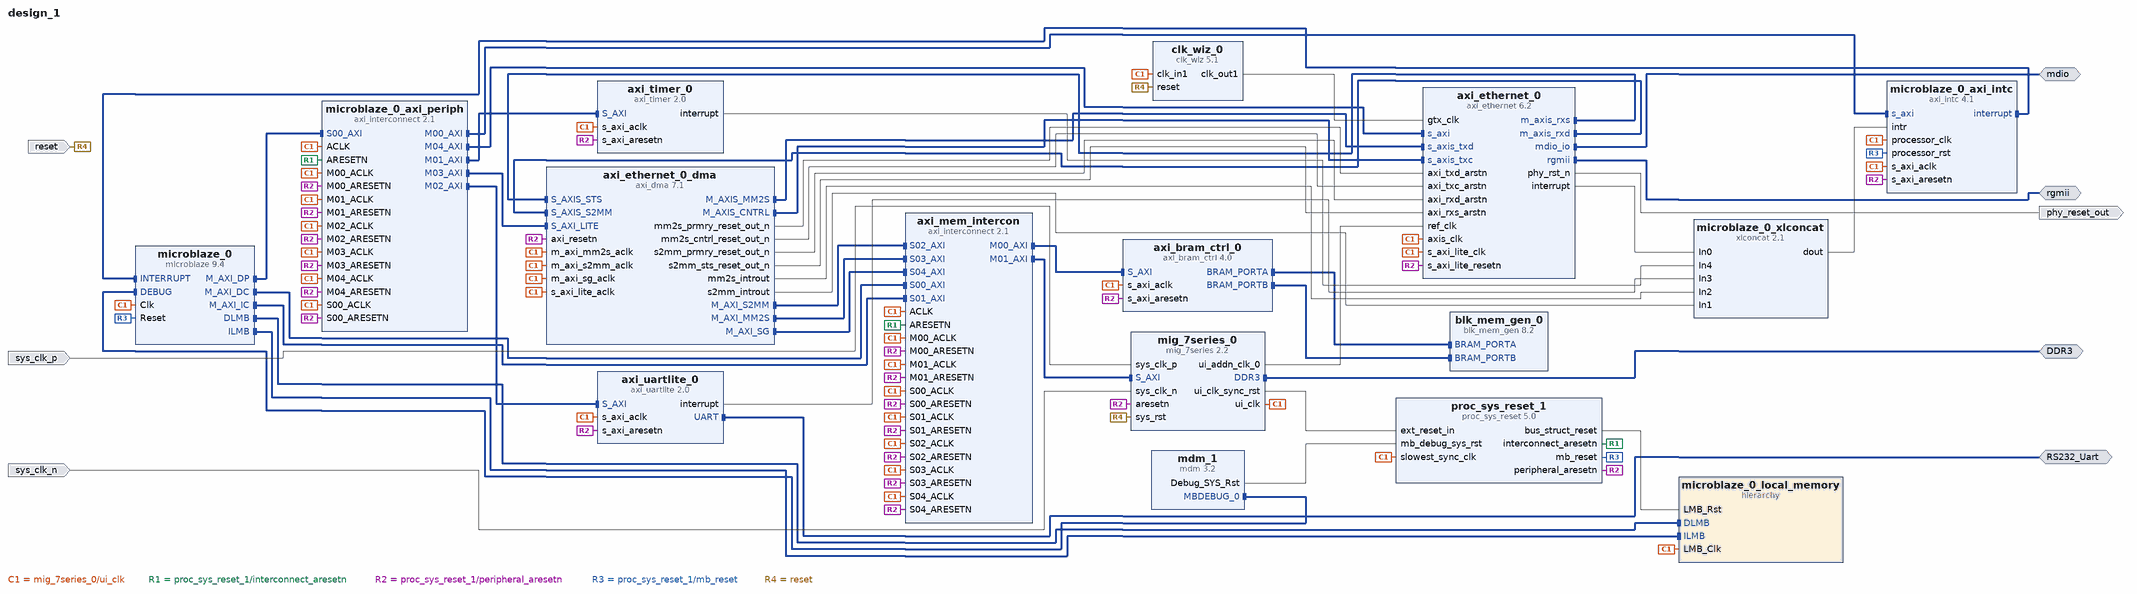
[diagram p0: block diagram of the top level]
# Vivado block design design_1, Vivado 2014.3
create_bd_design design_1

create_bd_intf_port -mode Master -vlnv xilinx.com:interface:uart_rtl:1.0 RS232_Uart
create_bd_intf_port -mode Master -vlnv xilinx.com:interface:ddrx_rtl:1.0 DDR3
create_bd_intf_port -mode Master -vlnv xilinx.com:interface:mdio_io:1.0 mdio
create_bd_intf_port -mode Master -vlnv xilinx.com:interface:rgmii_rtl:1.0 rgmii
create_bd_port -dir I -type rst reset
set_property -dict {CONFIG.POLARITY ACTIVE_HIGH} [get_bd_ports reset]
create_bd_port -dir I sys_clk_p
create_bd_port -dir I sys_clk_n
create_bd_port -dir O -type rst phy_reset_out

create_bd_cell -type hier microblaze_0_local_memory
create_bd_cell -type ip -vlnv xilinx.com:ip:xlconcat:2.1 microblaze_0_xlconcat
set_property -dict {CONFIG.NUM_PORTS 5} [get_bd_cells microblaze_0_xlconcat]
create_bd_cell -type ip -vlnv xilinx.com:ip:axi_bram_ctrl:4.0 axi_bram_ctrl_0
set_property -dict {CONFIG.SUPPORTS_NARROW_BURST 0} [get_bd_cells axi_bram_ctrl_0]
create_bd_cell -type ip -vlnv xilinx.com:ip:axi_ethernet:6.2 axi_ethernet_0
set_property -dict [list \
  CONFIG.USE_BOARD_FLOW true \
  CONFIG.ETHERNET_BOARD_INTERFACE rgmii \
  CONFIG.MDIO_BOARD_INTERFACE mdio_io \
  CONFIG.PHYRST_BOARD_INTERFACE phy_reset_out \
  CONFIG.RXMEM 32k \
  CONFIG.TXMEM 32k \
  CONFIG.TXCSUM Full \
  CONFIG.RXCSUM Full \
] [get_bd_cells axi_ethernet_0]
create_bd_cell -type ip -vlnv xilinx.com:ip:axi_dma:7.1 axi_ethernet_0_dma
set_property -dict [list \
  CONFIG.c_include_mm2s_dre 1 \
  CONFIG.c_mm2s_burst_size 32 \
  CONFIG.c_sg_use_stsapp_length 1 \
  CONFIG.c_include_s2mm_dre 1 \
  CONFIG.c_s2mm_burst_size 32 \
] [get_bd_cells axi_ethernet_0_dma]
create_bd_cell -type ip -vlnv xilinx.com:ip:axi_interconnect:2.1 axi_mem_intercon
set_property -dict {CONFIG.NUM_SI 5 CONFIG.NUM_MI 2 CONFIG.STRATEGY 2} [get_bd_cells axi_mem_intercon]
create_bd_cell -type ip -vlnv xilinx.com:ip:axi_timer:2.0 axi_timer_0
create_bd_cell -type ip -vlnv xilinx.com:ip:axi_uartlite:2.0 axi_uartlite_0
set_property -dict {CONFIG.USE_BOARD_FLOW true CONFIG.UARTLITE_BOARD_INTERFACE RS232_Uart} [get_bd_cells axi_uartlite_0]
create_bd_cell -type ip -vlnv xilinx.com:ip:blk_mem_gen:8.2 blk_mem_gen_0
set_property -dict [list \
  CONFIG.Memory_Type True_Dual_Port_RAM \
  CONFIG.Enable_B Use_ENB_Pin \
  CONFIG.Use_RSTB_Pin true \
  CONFIG.Port_B_Clock 100 \
  CONFIG.Port_B_Write_Rate 50 \
  CONFIG.Port_B_Enable_Rate 100 \
] [get_bd_cells blk_mem_gen_0]
create_bd_cell -type ip -vlnv xilinx.com:ip:clk_wiz:5.1 clk_wiz_0
set_property -dict {CONFIG.CLKOUT1_REQUESTED_OUT_FREQ 125.000 CONFIG.CLKOUT1_JITTER 125.247} [get_bd_cells clk_wiz_0]
create_bd_cell -type ip -vlnv xilinx.com:ip:mdm:3.2 mdm_1
create_bd_cell -type ip -vlnv xilinx.com:ip:microblaze:9.4 microblaze_0
set_property -dict [list \
  CONFIG.C_FREQ 100000000 \
  CONFIG.C_D_AXI 1 \
  CONFIG.C_D_LMB 1 \
  CONFIG.C_I_LMB 1 \
  CONFIG.C_M_AXI_DC_USER_SIGNALS 0 \
  CONFIG.C_M_AXI_IC_USER_SIGNALS 0 \
  CONFIG.G_TEMPLATE_LIST 2 \
  CONFIG.C_USE_MSR_INSTR 1 \
  CONFIG.C_USE_PCMP_INSTR 1 \
  CONFIG.C_USE_BARREL 1 \
  CONFIG.C_USE_DIV 1 \
  CONFIG.C_USE_HW_MUL 2 \
  CONFIG.C_USE_FPU 2 \
  CONFIG.C_DEBUG_ENABLED 1 \
  CONFIG.C_ICACHE_BASEADDR 0x80000000 \
  CONFIG.C_ICACHE_HIGHADDR 0xBFFFFFFF \
  CONFIG.C_USE_ICACHE 1 \
  CONFIG.C_CACHE_BYTE_SIZE 65536 \
  CONFIG.C_ICACHE_LINE_LEN 8 \
  CONFIG.C_ICACHE_ALWAYS_USED 1 \
  CONFIG.C_ICACHE_VICTIMS 0 \
  CONFIG.C_ICACHE_STREAMS 0 \
  CONFIG.C_DCACHE_BASEADDR 0x80000000 \
  CONFIG.C_DCACHE_HIGHADDR 0xBFFFFFFF \
  CONFIG.C_USE_DCACHE 1 \
  CONFIG.C_DCACHE_BYTE_SIZE 65536 \
  CONFIG.C_DCACHE_LINE_LEN 8 \
  CONFIG.C_DCACHE_ALWAYS_USED 1 \
  CONFIG.C_DCACHE_USE_WRITEBACK 1 \
  CONFIG.C_DCACHE_VICTIMS 0 \
  CONFIG.C_USE_INTERRUPT 2 \
  CONFIG.C_USE_EXT_BRK 0 \
  CONFIG.C_USE_EXT_NM_BRK 0 \
  CONFIG.C_USE_BRANCH_TARGET_CACHE 1 \
] [get_bd_cells microblaze_0]
create_bd_cell -type ip -vlnv xilinx.com:ip:axi_intc:4.1 microblaze_0_axi_intc
set_property -dict [list \
  CONFIG.C_KIND_OF_INTR 0xFFFFFFE8 \
  CONFIG.C_ASYNC_INTR 0xFFFFFFE1 \
  CONFIG.C_HAS_FAST 1 \
  CONFIG.C_DISABLE_SYNCHRONIZERS 1 \
] [get_bd_cells microblaze_0_axi_intc]
create_bd_cell -type ip -vlnv xilinx.com:ip:axi_interconnect:2.1 microblaze_0_axi_periph
set_property -dict {CONFIG.NUM_MI 5} [get_bd_cells microblaze_0_axi_periph]
create_bd_cell -type ip -vlnv xilinx.com:ip:mig_7series:2.2 mig_7series_0
set_property -dict {CONFIG.XML_INPUT_FILE mig_a.prj CONFIG.RESET_BOARD_INTERFACE reset} [get_bd_cells mig_7series_0]
create_bd_cell -type ip -vlnv xilinx.com:ip:proc_sys_reset:5.0 proc_sys_reset_1
set_property -dict {CONFIG.C_AUX_RESET_HIGH 0} [get_bd_cells proc_sys_reset_1]

# ---- hierarchy /microblaze_0_local_memory ----
current_bd_instance /microblaze_0_local_memory
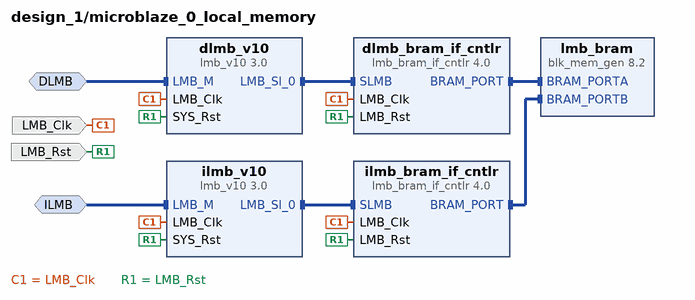
[diagram p1: block diagram inside /microblaze_0_local_memory]
create_bd_intf_pin -mode MirroredMaster -vlnv xilinx.com:interface:lmb_rtl:1.0 DLMB
create_bd_intf_pin -mode MirroredMaster -vlnv xilinx.com:interface:lmb_rtl:1.0 ILMB
create_bd_pin -dir I LMB_Clk
create_bd_pin -dir I LMB_Rst

create_bd_cell -type ip -vlnv xilinx.com:ip:lmb_v10:3.0 ilmb_v10
create_bd_cell -type ip -vlnv xilinx.com:ip:lmb_v10:3.0 dlmb_v10
create_bd_cell -type ip -vlnv xilinx.com:ip:lmb_bram_if_cntlr:4.0 dlmb_bram_if_cntlr
set_property -dict {CONFIG.C_MASK 0xc0000000 CONFIG.C_ECC 0} [get_bd_cells dlmb_bram_if_cntlr]
create_bd_cell -type ip -vlnv xilinx.com:ip:lmb_bram_if_cntlr:4.0 ilmb_bram_if_cntlr
set_property -dict {CONFIG.C_MASK 0x80000000 CONFIG.C_ECC 0} [get_bd_cells ilmb_bram_if_cntlr]
create_bd_cell -type ip -vlnv xilinx.com:ip:blk_mem_gen:8.2 lmb_bram
set_property -dict [list \
  CONFIG.Memory_Type True_Dual_Port_RAM \
  CONFIG.Enable_B Use_ENB_Pin \
  CONFIG.Use_RSTB_Pin true \
  CONFIG.Port_B_Clock 100 \
  CONFIG.Port_B_Write_Rate 50 \
  CONFIG.Port_B_Enable_Rate 100 \
  CONFIG.use_bram_block BRAM_Controller \
] [get_bd_cells lmb_bram]

# ---- connections ----

current_bd_instance /microblaze_0_local_memory
connect_bd_intf_net -intf_net microblaze_0_dlmb_bus [get_bd_intf_pins dlmb_v10/LMB_Sl_0] [get_bd_intf_pins dlmb_bram_if_cntlr/SLMB]
connect_bd_intf_net -intf_net microblaze_0_ilmb_bus [get_bd_intf_pins ilmb_v10/LMB_Sl_0] [get_bd_intf_pins ilmb_bram_if_cntlr/SLMB]
connect_bd_intf_net -intf_net microblaze_0_dlmb_cntlr [get_bd_intf_pins dlmb_bram_if_cntlr/BRAM_PORT] [get_bd_intf_pins lmb_bram/BRAM_PORTA]
connect_bd_intf_net -intf_net microblaze_0_ilmb_cntlr [get_bd_intf_pins ilmb_bram_if_cntlr/BRAM_PORT] [get_bd_intf_pins lmb_bram/BRAM_PORTB]
connect_bd_intf_net -intf_net microblaze_0_dlmb [get_bd_intf_pins DLMB] [get_bd_intf_pins dlmb_v10/LMB_M]
connect_bd_intf_net -intf_net microblaze_0_ilmb [get_bd_intf_pins ILMB] [get_bd_intf_pins ilmb_v10/LMB_M]
connect_bd_net -net microblaze_0_Clk [get_bd_pins LMB_Clk] \
  [get_bd_pins ilmb_v10/LMB_Clk] [get_bd_pins dlmb_v10/LMB_Clk] [get_bd_pins dlmb_bram_if_cntlr/LMB_Clk] \
  [get_bd_pins ilmb_bram_if_cntlr/LMB_Clk]
connect_bd_net -net proc_sys_reset_1_bus_struct_reset [get_bd_pins LMB_Rst] \
  [get_bd_pins ilmb_v10/SYS_Rst] [get_bd_pins dlmb_v10/SYS_Rst] [get_bd_pins dlmb_bram_if_cntlr/LMB_Rst] \
  [get_bd_pins ilmb_bram_if_cntlr/LMB_Rst]

current_bd_instance /
connect_bd_intf_net [get_bd_intf_pins microblaze_0/DLMB] [get_bd_intf_pins microblaze_0_local_memory/DLMB]
connect_bd_intf_net [get_bd_intf_pins microblaze_0/ILMB] [get_bd_intf_pins microblaze_0_local_memory/ILMB]
connect_bd_intf_net -intf_net microblaze_0_axi_dp [get_bd_intf_pins microblaze_0_axi_periph/S00_AXI] [get_bd_intf_pins microblaze_0/M_AXI_DP]
connect_bd_intf_net [get_bd_intf_pins microblaze_0_axi_intc/interrupt] [get_bd_intf_pins microblaze_0/INTERRUPT]
connect_bd_intf_net -intf_net microblaze_0_intc_axi [get_bd_intf_pins microblaze_0_axi_periph/M00_AXI] [get_bd_intf_pins microblaze_0_axi_intc/s_axi]
connect_bd_intf_net [get_bd_intf_pins mdm_1/MBDEBUG_0] [get_bd_intf_pins microblaze_0/DEBUG]
connect_bd_intf_net [get_bd_intf_pins microblaze_0_axi_periph/M01_AXI] [get_bd_intf_pins axi_timer_0/S_AXI]
connect_bd_intf_net [get_bd_intf_pins microblaze_0_axi_periph/M02_AXI] [get_bd_intf_pins axi_uartlite_0/S_AXI]
connect_bd_intf_net [get_bd_intf_pins axi_bram_ctrl_0/BRAM_PORTA] [get_bd_intf_pins blk_mem_gen_0/BRAM_PORTA]
connect_bd_intf_net [get_bd_intf_pins axi_bram_ctrl_0/BRAM_PORTB] [get_bd_intf_pins blk_mem_gen_0/BRAM_PORTB]
connect_bd_intf_net [get_bd_intf_pins microblaze_0/M_AXI_DC] [get_bd_intf_pins axi_mem_intercon/S00_AXI]
connect_bd_intf_net [get_bd_intf_pins axi_mem_intercon/M00_AXI] [get_bd_intf_pins axi_bram_ctrl_0/S_AXI]
connect_bd_intf_net [get_bd_intf_pins microblaze_0/M_AXI_IC] [get_bd_intf_pins axi_mem_intercon/S01_AXI]
connect_bd_intf_net [get_bd_intf_pins axi_mem_intercon/M01_AXI] [get_bd_intf_pins mig_7series_0/S_AXI]
connect_bd_intf_net [get_bd_intf_pins axi_ethernet_0_dma/M_AXIS_MM2S] [get_bd_intf_pins axi_ethernet_0/s_axis_txd]
connect_bd_intf_net [get_bd_intf_pins axi_ethernet_0_dma/M_AXIS_CNTRL] [get_bd_intf_pins axi_ethernet_0/s_axis_txc]
connect_bd_intf_net [get_bd_intf_pins axi_ethernet_0_dma/S_AXIS_STS] [get_bd_intf_pins axi_ethernet_0/m_axis_rxs]
connect_bd_intf_net [get_bd_intf_pins axi_ethernet_0_dma/S_AXIS_S2MM] [get_bd_intf_pins axi_ethernet_0/m_axis_rxd]
connect_bd_intf_net [get_bd_intf_pins axi_ethernet_0_dma/M_AXI_S2MM] [get_bd_intf_pins axi_mem_intercon/S02_AXI]
connect_bd_intf_net [get_bd_intf_pins axi_ethernet_0_dma/M_AXI_MM2S] [get_bd_intf_pins axi_mem_intercon/S03_AXI]
connect_bd_intf_net [get_bd_intf_pins axi_ethernet_0_dma/M_AXI_SG] [get_bd_intf_pins axi_mem_intercon/S04_AXI]
connect_bd_intf_net [get_bd_intf_pins microblaze_0_axi_periph/M03_AXI] [get_bd_intf_pins axi_ethernet_0_dma/S_AXI_LITE]
connect_bd_intf_net [get_bd_intf_pins microblaze_0_axi_periph/M04_AXI] [get_bd_intf_pins axi_ethernet_0/s_axi]
connect_bd_intf_net [get_bd_intf_ports RS232_Uart] [get_bd_intf_pins axi_uartlite_0/UART]
connect_bd_intf_net [get_bd_intf_ports DDR3] [get_bd_intf_pins mig_7series_0/DDR3]
connect_bd_intf_net -intf_net axi_ethernet_0_mdio [get_bd_intf_ports mdio] [get_bd_intf_pins axi_ethernet_0/mdio_io]
connect_bd_intf_net [get_bd_intf_ports rgmii] [get_bd_intf_pins axi_ethernet_0/rgmii]
connect_bd_net -net microblaze_0_intr [get_bd_pins microblaze_0_xlconcat/dout] [get_bd_pins microblaze_0_axi_intc/intr]
connect_bd_net -net microblaze_0_Clk [get_bd_pins mig_7series_0/ui_clk] \
  [get_bd_pins microblaze_0_local_memory/LMB_Clk] [get_bd_pins axi_bram_ctrl_0/s_axi_aclk] \
  [get_bd_pins axi_ethernet_0/s_axi_lite_clk] [get_bd_pins axi_ethernet_0/axis_clk] \
  [get_bd_pins axi_ethernet_0_dma/s_axi_lite_aclk] [get_bd_pins axi_ethernet_0_dma/m_axi_sg_aclk] \
  [get_bd_pins axi_ethernet_0_dma/m_axi_mm2s_aclk] [get_bd_pins axi_ethernet_0_dma/m_axi_s2mm_aclk] \
  [get_bd_pins axi_mem_intercon/ACLK] [get_bd_pins axi_mem_intercon/S00_ACLK] [get_bd_pins axi_mem_intercon/S01_ACLK] \
  [get_bd_pins axi_mem_intercon/S02_ACLK] [get_bd_pins axi_mem_intercon/S03_ACLK] [get_bd_pins axi_mem_intercon/S04_ACLK] \
  [get_bd_pins axi_mem_intercon/M00_ACLK] [get_bd_pins axi_mem_intercon/M01_ACLK] [get_bd_pins axi_timer_0/s_axi_aclk] \
  [get_bd_pins axi_uartlite_0/s_axi_aclk] [get_bd_pins clk_wiz_0/clk_in1] [get_bd_pins microblaze_0/Clk] \
  [get_bd_pins microblaze_0_axi_intc/s_axi_aclk] [get_bd_pins microblaze_0_axi_intc/processor_clk] \
  [get_bd_pins microblaze_0_axi_periph/ACLK] [get_bd_pins microblaze_0_axi_periph/S00_ACLK] \
  [get_bd_pins microblaze_0_axi_periph/M00_ACLK] [get_bd_pins microblaze_0_axi_periph/M01_ACLK] \
  [get_bd_pins microblaze_0_axi_periph/M02_ACLK] [get_bd_pins microblaze_0_axi_periph/M03_ACLK] \
  [get_bd_pins microblaze_0_axi_periph/M04_ACLK] [get_bd_pins proc_sys_reset_1/slowest_sync_clk]
connect_bd_net [get_bd_pins proc_sys_reset_1/bus_struct_reset] [get_bd_pins microblaze_0_local_memory/LMB_Rst]
connect_bd_net [get_bd_pins proc_sys_reset_1/interconnect_aresetn] \
  [get_bd_pins axi_mem_intercon/ARESETN] [get_bd_pins microblaze_0_axi_periph/ARESETN]
connect_bd_net [get_bd_pins mdm_1/Debug_SYS_Rst] [get_bd_pins proc_sys_reset_1/mb_debug_sys_rst]
connect_bd_net [get_bd_pins proc_sys_reset_1/peripheral_aresetn] \
  [get_bd_pins axi_bram_ctrl_0/s_axi_aresetn] [get_bd_pins axi_ethernet_0/s_axi_lite_resetn] \
  [get_bd_pins axi_ethernet_0_dma/axi_resetn] [get_bd_pins axi_mem_intercon/S00_ARESETN] \
  [get_bd_pins axi_mem_intercon/S01_ARESETN] [get_bd_pins axi_mem_intercon/S02_ARESETN] \
  [get_bd_pins axi_mem_intercon/S03_ARESETN] [get_bd_pins axi_mem_intercon/S04_ARESETN] \
  [get_bd_pins axi_mem_intercon/M00_ARESETN] [get_bd_pins axi_mem_intercon/M01_ARESETN] \
  [get_bd_pins axi_timer_0/s_axi_aresetn] [get_bd_pins axi_uartlite_0/s_axi_aresetn] \
  [get_bd_pins microblaze_0_axi_intc/s_axi_aresetn] [get_bd_pins microblaze_0_axi_periph/S00_ARESETN] \
  [get_bd_pins microblaze_0_axi_periph/M00_ARESETN] [get_bd_pins microblaze_0_axi_periph/M01_ARESETN] \
  [get_bd_pins microblaze_0_axi_periph/M02_ARESETN] [get_bd_pins microblaze_0_axi_periph/M03_ARESETN] \
  [get_bd_pins microblaze_0_axi_periph/M04_ARESETN] [get_bd_pins mig_7series_0/aresetn]
connect_bd_net [get_bd_pins proc_sys_reset_1/mb_reset] [get_bd_pins microblaze_0/Reset] [get_bd_pins microblaze_0_axi_intc/processor_rst]
connect_bd_net [get_bd_pins mig_7series_0/ui_clk_sync_rst] [get_bd_pins proc_sys_reset_1/ext_reset_in]
connect_bd_net [get_bd_pins axi_timer_0/interrupt] [get_bd_pins microblaze_0_xlconcat/In4]
connect_bd_net [get_bd_pins axi_uartlite_0/interrupt] [get_bd_pins microblaze_0_xlconcat/In3]
connect_bd_net [get_bd_ports reset] [get_bd_pins clk_wiz_0/reset] [get_bd_pins mig_7series_0/sys_rst]
connect_bd_net [get_bd_ports sys_clk_p] [get_bd_pins mig_7series_0/sys_clk_p]
connect_bd_net [get_bd_ports sys_clk_n] [get_bd_pins mig_7series_0/sys_clk_n]
connect_bd_net [get_bd_pins axi_ethernet_0_dma/mm2s_prmry_reset_out_n] [get_bd_pins axi_ethernet_0/axi_txd_arstn]
connect_bd_net [get_bd_pins axi_ethernet_0_dma/mm2s_cntrl_reset_out_n] [get_bd_pins axi_ethernet_0/axi_txc_arstn]
connect_bd_net [get_bd_pins axi_ethernet_0_dma/s2mm_prmry_reset_out_n] [get_bd_pins axi_ethernet_0/axi_rxd_arstn]
connect_bd_net [get_bd_pins axi_ethernet_0_dma/s2mm_sts_reset_out_n] [get_bd_pins axi_ethernet_0/axi_rxs_arstn]
connect_bd_net [get_bd_pins mig_7series_0/ui_addn_clk_0] [get_bd_pins axi_ethernet_0/ref_clk]
connect_bd_net [get_bd_pins axi_ethernet_0_dma/mm2s_introut] [get_bd_pins microblaze_0_xlconcat/In2]
connect_bd_net [get_bd_pins axi_ethernet_0_dma/s2mm_introut] [get_bd_pins microblaze_0_xlconcat/In1]
connect_bd_net [get_bd_pins axi_ethernet_0/interrupt] [get_bd_pins microblaze_0_xlconcat/In0]
connect_bd_net [get_bd_pins axi_ethernet_0/phy_rst_n] [get_bd_ports phy_reset_out]
connect_bd_net [get_bd_pins clk_wiz_0/clk_out1] [get_bd_pins axi_ethernet_0/gtx_clk]

# ---- address map ----
assign_bd_address -offset 0x80000000 -range 1G -target_address_space [get_bd_addr_spaces axi_ethernet_0_dma/Data_MM2S] [get_bd_addr_segs mig_7series_0/memmap/memaddr]
assign_bd_address -offset 0xC0000000 -range 4K -target_address_space [get_bd_addr_spaces axi_ethernet_0_dma/Data_MM2S] [get_bd_addr_segs axi_bram_ctrl_0/S_AXI/Mem0]
assign_bd_address -offset 0x80000000 -range 1G -target_address_space [get_bd_addr_spaces axi_ethernet_0_dma/Data_S2MM] [get_bd_addr_segs mig_7series_0/memmap/memaddr]
assign_bd_address -offset 0xC0000000 -range 4K -target_address_space [get_bd_addr_spaces axi_ethernet_0_dma/Data_S2MM] [get_bd_addr_segs axi_bram_ctrl_0/S_AXI/Mem0]
assign_bd_address -offset 0x80000000 -range 1G -target_address_space [get_bd_addr_spaces axi_ethernet_0_dma/Data_SG] [get_bd_addr_segs mig_7series_0/memmap/memaddr]
assign_bd_address -offset 0xC0000000 -range 4K -target_address_space [get_bd_addr_spaces axi_ethernet_0_dma/Data_SG] [get_bd_addr_segs axi_bram_ctrl_0/S_AXI/Mem0]
assign_bd_address -offset 0x0 -range 64K -target_address_space [get_bd_addr_spaces microblaze_0/Data] [get_bd_addr_segs microblaze_0_local_memory/dlmb_bram_if_cntlr/SLMB/Mem]
assign_bd_address -offset 0x40600000 -range 64K -target_address_space [get_bd_addr_spaces microblaze_0/Data] [get_bd_addr_segs axi_uartlite_0/S_AXI/Reg]
assign_bd_address -offset 0x41200000 -range 64K -target_address_space [get_bd_addr_spaces microblaze_0/Data] [get_bd_addr_segs microblaze_0_axi_intc/s_axi/Reg]
assign_bd_address -offset 0x41C00000 -range 64K -target_address_space [get_bd_addr_spaces microblaze_0/Data] [get_bd_addr_segs axi_timer_0/S_AXI/Reg]
assign_bd_address -offset 0x41E00000 -range 64K -target_address_space [get_bd_addr_spaces microblaze_0/Data] [get_bd_addr_segs axi_ethernet_0_dma/S_AXI_LITE/Reg]
assign_bd_address -offset 0x44A00000 -range 256K -target_address_space [get_bd_addr_spaces microblaze_0/Data] [get_bd_addr_segs axi_ethernet_0/s_axi/Reg]
assign_bd_address -offset 0x80000000 -range 1G -target_address_space [get_bd_addr_spaces microblaze_0/Data] [get_bd_addr_segs mig_7series_0/memmap/memaddr]
assign_bd_address -offset 0xC0000000 -range 4K -target_address_space [get_bd_addr_spaces microblaze_0/Data] [get_bd_addr_segs axi_bram_ctrl_0/S_AXI/Mem0]
assign_bd_address -offset 0x0 -range 64K -target_address_space [get_bd_addr_spaces microblaze_0/Instruction] [get_bd_addr_segs microblaze_0_local_memory/ilmb_bram_if_cntlr/SLMB/Mem]
assign_bd_address -offset 0x80000000 -range 1G -target_address_space [get_bd_addr_spaces microblaze_0/Instruction] [get_bd_addr_segs mig_7series_0/memmap/memaddr]
assign_bd_address -offset 0xC0000000 -range 4K -target_address_space [get_bd_addr_spaces microblaze_0/Instruction] [get_bd_addr_segs axi_bram_ctrl_0/S_AXI/Mem0]

validate_bd_design
save_bd_design
